# Altium schematic sheet DMP_SEM_POWER.SchDoc: Target MCU
size A3; Organization: Microchip; Address1: Vestre Rosten 79; Address2: N-7075 TILLER; Address3: NORWAY; DocumentNumber: A09-2748; Revision: 11; SheetNumber: 1; SheetTotal: 4; DrawnBy: Microchip Norway; Engineer: HN; PageSetup: Record=PageOptions|CenterHorizontal=True|CenterVertical=True|PrintScale=1.01|XCorrection=1.00|YCorrection=1.00|PrintKind=1|BorderSize=5000000|LeftOffset=0|BottomOffset=0|Orientation=2|PaperLength=1000|PaperWidth=1000|Scale=100|PaperSource=7|PrintQuality=-4|MediaType=1|DitherType=10|PaperKind=A3 (297 x 420 mm)|PrintScaleMode=1; ProjectTitle: SAM E54 Xplained Pro; PCBNumber: A08-2643; PCBRevision: 4; ProjectName: SAM E54 Xplained Pro
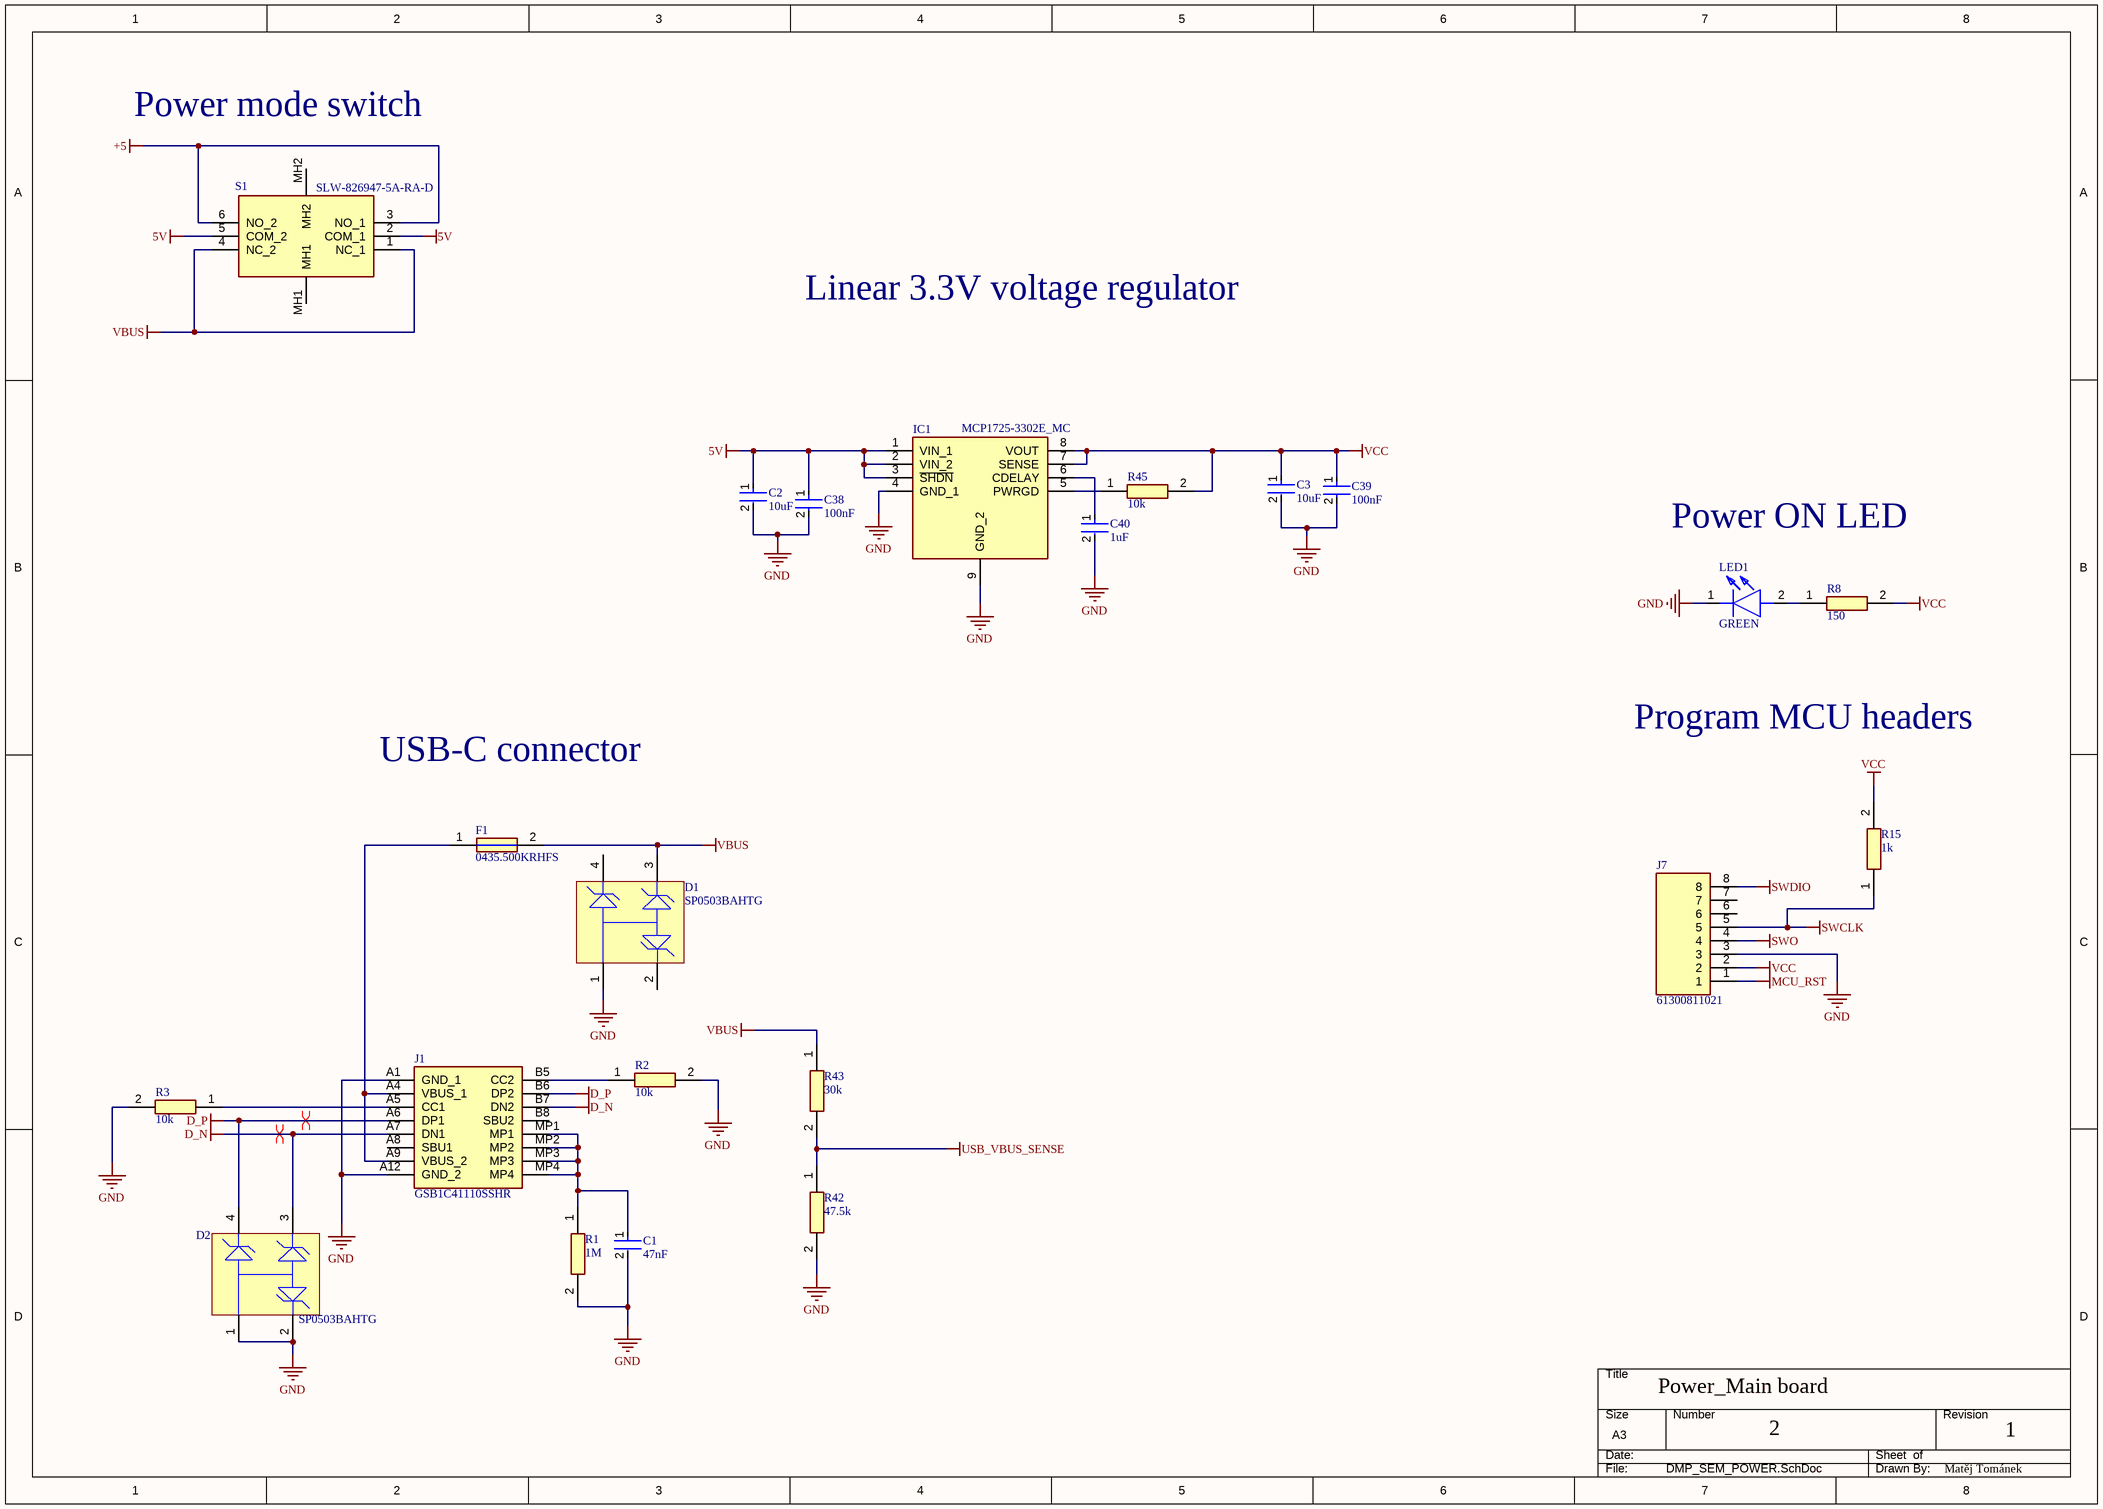
[diagram p0: DMP_SEM_POWER.SchDoc]

## Parts
C1  47nF  [C0603X473J3RAC3316]
C2  10uF  [CL10A106KO8NQNC]
C3  10uF  [CL10A106KO8NQNC]
C38  100nF  [CL05B104KO5NNNC]
C39  100nF  [CL05B104KO5NNNC]
C40  1uF  [GRM155C81C105KE11D]
D1  SP0503BAHTG  [SP0503BAHTG]
D2  SP0503BAHTG  [SP0503BAHTG]
F1  0435.500KRHFS  [0435.500KRHFS]
IC1  MCP1725-3302E_MC  [MCP1725-3302E_MC]
J1  GSB1C41110SSHR  [GSB1C41110SSHR]
J7  61300811021  [61300811021]
LED1  GREEN  [SMLEN3EC8TT86]
R1  1M  [RC0402FR-071ML]
R2  10k  [CRCW060310K0FKEA]
R3  10k  [CRCW060310K0FKEA]
R8  150  [CRCW0402150RFKEDHP]
R15  1k  [RC0603FR-071KL]
R42  47.5k  [ERJ-PA3D4752V]
R43  30k  [RT0603DRD0730KL]
R45  10k  [CRCW060310K0FKEA]
S1  SLW-826947-5A-RA-D  [SLW-826947-5A-RA-D]

## Nets
5V: C2.1 C38.1 IC1.1(VIN_1) IC1.2(VIN_2) IC1.3(~{SHDN}) S1.2(COM_1) S1.5(COM_2)
+5: S1.3(NO_1) S1.6(NO_2)
D_N: D2.3 J1.A7(DN1) J1.B7(DN2)
D_P: D2.4 J1.A6(DP1) J1.B6(DP2)
GND: C1.2 C2.2 C3.2 C38.2 C39.2 C40.2 D1.1 D2.1 D2.2 IC1.4(GND_1) IC1.9(GND_2) J1.A1(GND_1) J1.A12(GND_2) J7.3 LED1.1(K) R1.2 R2.2 R3.2 R42.2
MCU_RST: J7.1
SWCLK: J7.5 R15.1
SWDIO: J7.8
SWO: J7.4
USB_VBUS_SENSE: R42.1 R43.2
VBUS: D1.3 F1.2 R43.1 S1.1(NC_1) S1.4(NC_2)
VCC: C3.1 C39.1 IC1.7(SENSE) IC1.8(VOUT) J7.2 R8.2 R15.2 R45.2
NetC1_1: C1.1 J1.MP1 J1.MP2 J1.MP3 J1.MP4 R1.1
NetC40_1: C40.1 IC1.6(CDELAY)
NetF1_1: F1.1 J1.A4(VBUS_1) J1.A9(VBUS_2)
NetIC1_5: IC1.5(PWRGD) R45.1
NetJ1_A5: J1.A5(CC1) R3.1
NetJ1_B5: J1.B5(CC2) R2.1
NetLED1_2: LED1.2(A) R8.1

Not connected (* = marked no-connect by the designer): D1 2 4; J1 A8(SBU1) B8(SBU2); J7 6 7; S1 MH1 MH2

## Layout directives
differential pair: D_N, D_P

## Notes on the sheet
- Power mode switch
- Linear 3.3V voltage regulator
- Power ON LED
- USB-C connector
- Program MCU headers
- Power_Main board
- 2
- 1
- Matěj Tománek
- DWG. NO.
- REV.
- SHT.
- THIS DOCUMENT AND THE DATA DISCLOSED HEREIN OR HEREWITH IS THE PROPERTY OF ALTIUM LIMITED AND MAY BE FREELY DISTRIBUTED IN WHOLE. NO RIGHTS ARE RESERVED OR EXPRESS OR IMPLIED WARANTEE GIVEN.
- REVISION
- DESCRIPTION
- DATE
- APPROVED
- ENG:
- APPROVALS
- PROJECT
- DSN:
- CHK:
- REFERENCE DOCUMENTS
- PROJECT REVISION:
- TITLE
- DOCUMENT REVISION:
- DESIGN ITEM:
- BOM:
- FAB DWG:
- PCB DWG:
- ASSY DWG:
- SCALE:
- SIZE
- B
- CAGE CODE
- FILE NAME
- DWG NO.
- SHEET
- OF
- REV

## Library data of the parts
C1 = C0603X473J3RAC3316: Capacitor C0603X473J3RAC3316
C2 C3 = CL10A106KO8NQNC: Capacitor CL10A106KO8NQNC
C38 C39 = CL05B104KO5NNNC: Capacitor CL05B104KO5NNNC
C40 = GRM155C81C105KE11D: Capacitor GRM155C81C105KE11D
D1 D2 = SP0503BAHTG: TVS Diodes SP0503BAHTG
F1 = 0435.500KRHFS: Fuse 0435.500KRHFS
IC1 = MCP1725-3302E_MC: Linear voltage regulator  MCP1725-3302E_MC
J1 = GSB1C41110SSHR: USB-C Connector
J7 = 61300811021: Programing connector 61300811021
LED1 = SMLEN3EC8TT86: GREEN LED Diode
R1 = RC0402FR-071ML: Resistor RC0402FR-071ML
R2 R3 R45 = CRCW060310K0FKEA: Resistor CRCW060310K0FKEA
R8 = CRCW0402150RFKEDHP: Resistor CRCW0402150RFKEDHP
R15 = RC0603FR-071KL: Resistor RC0603FR-071KL
R42 = ERJ-PA3D4752V: Resistor ERJ-PA3D4752V
R43 = RT0603DRD0730KL: Resistor RT0603DRD0730KL
S1 = SLW-826947-5A-RA-D: Switch SLW-826947-5A-RA-D